# EAGLE design battle bunnies (EAGLE 7.7.0)
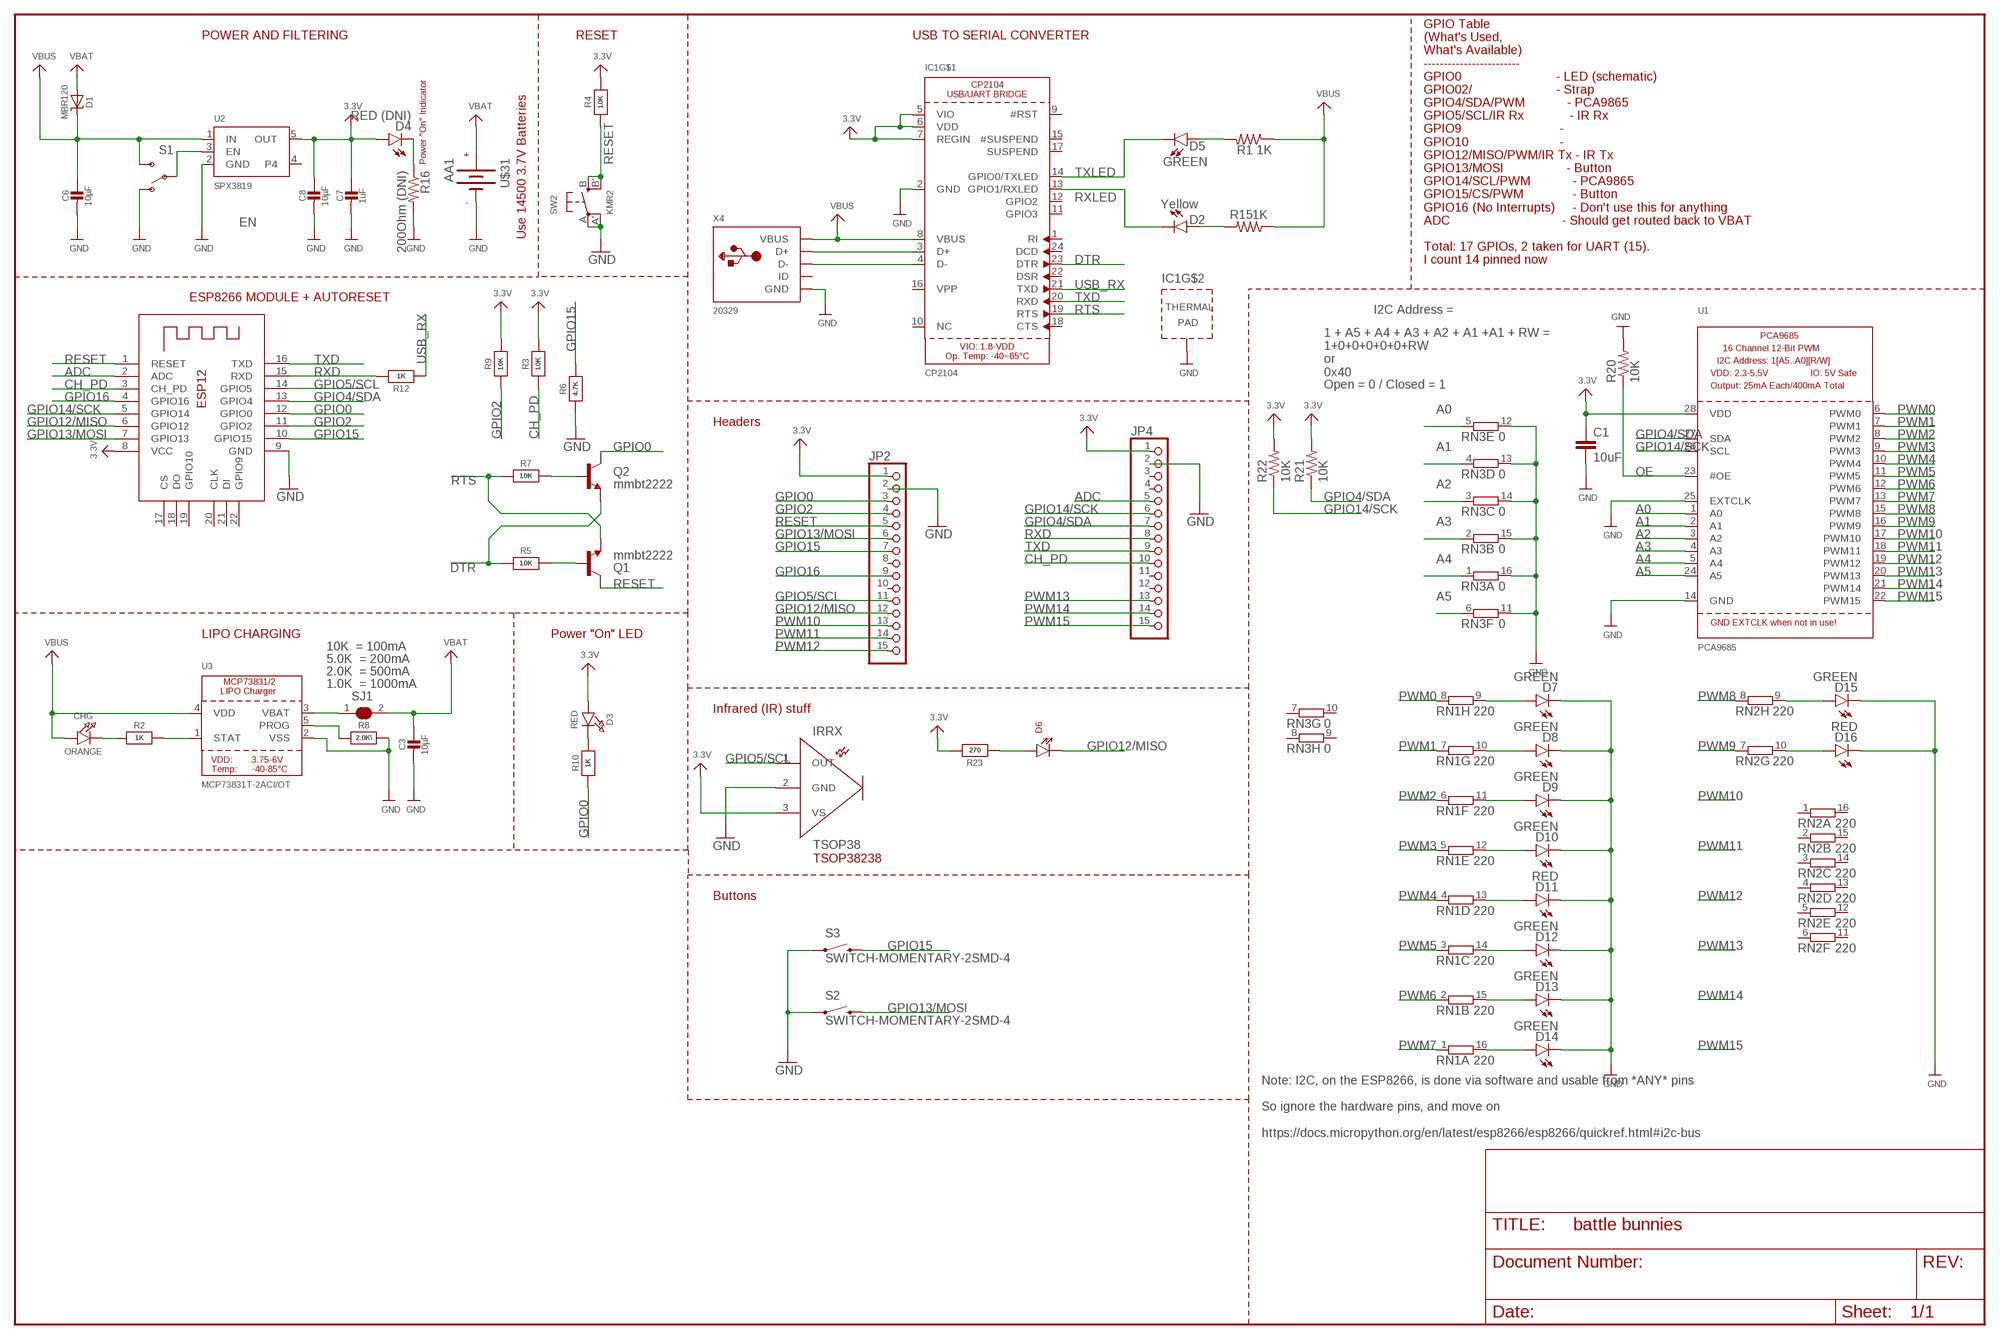
[diagram p0: schematic, sheet 1]

## Parts
C1  10uF  10UF10V10%(0805)  [0805-CAP]
C3  10µF  CAP_CERAMIC0805-NOOUTLINE  [0805-NO]
C6  10µF  CAP_CERAMIC0805-NOOUTLINE  [0805-NO]
C7  1uF  CAP_CERAMIC0603_NO  [0603-NO]
C8  10µF  CAP_CERAMIC0805-NOOUTLINE  [0805-NO]
CHG  ORANGE  LED0805_NOOUTLINE  [CHIPLED_0805_NOOUTLINE]
D1  MBR120  DIODE-SCHOTTKYSOD-123  [SOD-123]
D2  Yellow  LED-YELLOW0603  [LED-0603]
D3  RED  LED0805_NOOUTLINE  [CHIPLED_0805_NOOUTLINE]
D4  RED (DNI)  LED-RED0603  [LED-0603]
D5  GREEN  LED-GREEN0603  [LED-0603]
D6  LTE-302  [LTE-302]
D7  GREEN  LED-GREEN0603  [LED-0603]
D8  GREEN  LED-GREEN0603  [LED-0603]
D9  GREEN  LED-GREEN0603  [LED-0603]
D10  GREEN  LED-GREEN0603  [LED-0603]
D11  RED  LED-RED0603  [LED-0603]
D12  GREEN  LED-GREEN0603  [LED-0603]
D13  GREEN  LED-GREEN0603  [LED-0603]
D14  GREEN  LED-GREEN0603  [LED-0603]
D15  GREEN  LED-GREEN0603  [LED-0603]
D16  RED  LED-RED0603  [LED-0603]
IC1  CP2104  [QFN24_4MM_SMSC]
IRRX  TSOP38  [TSOP38]
JP2  PINHD-1X15  [1X15]
JP4  PINHD-1X15  [1X15]
Q1  mmbt2222  TRANSISTOR_NPNSOT23-3  [SOT23-3]
Q2  mmbt2222  TRANSISTOR_NPNSOT23-3  [SOT23-3]
R1  1K  1KOHM-1/10W-1%(0603)  [0603-RES]
R2  1K  RESISTOR_0603_NOOUT  [0603-NO]
R3  10K  RESISTOR_0603_NOOUT  [0603-NO]
R4  10K  RESISTOR_0603_NOOUT  [0603-NO]
R5  10K  RESISTOR_0603_NOOUT  [0603-NO]
R6  4.7K  RESISTOR_0603_NOOUT  [0603-NO]
R7  10K  RESISTOR_0603MP  [_0603MP]
R8  2.0K\  RESISTOR_0603_NOOUT  [0603-NO]
R9  10K  RESISTOR_0603_NOOUT  [0603-NO]
R10  1K  RESISTOR_0603_NOOUT  [0603-NO]
R12  1K  RESISTOR_0603MP  [_0603MP]
R15  1K  1KOHM-1/10W-1%(0603)  [0603-RES]
R16  200Ohm (DNI)  200OHM1/10W1%(0603)  [0603-RES]
R20  10K  RESISTOR0805-RES  [0805]
R21  10K  RESISTOR0805-RES  [0805]
R22  10K  RESISTOR0805-RES  [0805]
R23  270  RESISTOR_0603_NOOUT  [0603-NO]
RN1  220  8R-NEXB2HV  [EXB2HV]
RN2  220  8R-NEXB2HV  [EXB2HV]
RN3  0  8R-NEXB2HV  [EXB2HV]
S1  SWITCH-SPDT-SMD-A  [SWITCH-SPST-SMD-A]
S2  SWITCH-MOMENTARY-2SMD-4  [TACTILE_SWITCH_TALL]
S3  SWITCH-MOMENTARY-2SMD-4  [TACTILE_SWITCH_TALL]
SJ1  SOLDERJUMPER_CLOSED  [SOLDERJUMPER_CLOSEDWIRE@1]
SW2  KMR2  SWITCH_TACT_SMT4.6X2.8  [BTN_KMR2_4.6X2.8]
U1  PCA9685  [TSSOP28]
U2  SPX3819  VREG_SOT23-5  [SOT23-5]
U3  MCP73831T-2ACI/OT  MCP73831/2  [SOT23-5]
U$31  AA1  [AA1]
X2  ESP-12  ESP-12E  [ESP-12E]
X4  20329  USB_MICRO_20329_V2  [4UCONN_20329_V2]

## Nets
3.3V: C1.1 C7.1 C8.1 D3.A D4.A IC1.5(VIO) IC1.6(VDD) IC1.7(REGIN) IRRX.3(VS) JP2.1 JP4.1 R1.1 R3.2 R4.2 R9.2 R15.1 R21.2 R22.2 R23.2 U1.28(VDD) U2.5(OUT) X2.8(VCC) ; supply symbol labelled VBUS
A0: RN3.5 U1.1(A0)
A1: RN3.4 U1.2(A1)
A2: RN3.3 U1.3(A2)
A3: RN3.2 U1.4(A3)
A4: RN3.1 U1.5(A4)
A5: RN3.6 U1.24(A5)
ADC: JP4.5 X2.2(ADC)
CH_PD: JP4.10 R3.1 X2.3(CH_PD)
DTR: IC1.23(DTR) Q2.2(E) R5.1
EN: S1.2(P) U2.3(EN)
GND: C1.2 C3.2 C6.2 C7.2 C8.2 D7.C D8.C D9.C D10.C D11.C D12.C D13.C D14.C D15.C D16.C IC1.2(GND) IC1.THERM(TP) IRRX.2(GND) JP2.2 JP4.2 R6.1 R8.2 R16.2 R20.2 RN3.11 RN3.12 RN3.13 RN3.14 RN3.15 RN3.16 S1.1(O) S2.A2 S3.A2 SW2.A'(P1) SW2.A(P) U1.14(GND) U1.25(EXTCLK) U2.2(GND) U3.2(VSS) U$31.NEG(-) X2.9(GND) X4.BASE@1(GND) X4.BASE@2(GND) X4.GND X4.SPRT@1(GND) X4.SPRT@2(GND) X4.SPRT@3(GND) X4.SPRT@4(GND)
GPIO0: JP2.3 Q2.3(C) R10.1 X2.12(GPIO0)
GPIO2: JP2.4 R9.1 X2.11(GPIO2)
GPIO4/SDA: JP4.7 R21.1 U1.27(SDA) X2.13(GPIO4)
GPIO5/SCL: IRRX.1(OUT) JP2.11 X2.14(GPIO5)
GPIO12/MISO: D6.C JP2.12 X2.6(GPIO12)
GPIO13/MOSI: JP2.6 S2.B2 X2.7(GPIO13)
GPIO14/SCK: JP4.6 R22.1 U1.26(SCL) X2.5(GPIO14)
GPIO15: JP2.7 R6.2 S3.B2 X2.10(GPIO15)
GPIO16: JP2.9 X2.4(GPIO16)
N$1: CHG.C R2.1
N$2: R8.1 U3.5(PROG)
N$3: R2.2 U3.1(STAT)
N$4: D4.C R16.1
N$5: D3.C R10.2
N$8: D5.A R1.2
N$9: SJ1.1 U3.3(VBAT)
N$10: D2.A R15.2
N$12: Q1.1(B) R5.2
N$13: Q2.1(B) R7.2
N$14: D6.A R23.1
N$15: D13.A RN1.15
N$16: D14.A RN1.16
N$17: D12.A RN1.14
N$18: D11.A RN1.13
N$19: D10.A RN1.12
N$20: D9.A RN1.11
N$21: D8.A RN1.10
N$22: D7.A RN1.9
N$23: D15.A RN2.9
N$24: D16.A RN2.10
OE: R20.1 U1.23(#OE)
PWM0: RN1.8 U1.6(PWM0)
PWM1: RN1.7 U1.7(PWM1)
PWM2: RN1.6 U1.8(PWM2)
PWM3: RN1.5 U1.9(PWM3)
PWM4: RN1.4 U1.10(PWM4)
PWM5: RN1.3 U1.11(PWM5)
PWM6: RN1.2 U1.12(PWM6)
PWM7: RN1.1 U1.13(PWM7)
PWM8: RN2.8 U1.15(PWM8)
PWM9: RN2.7 U1.16(PWM9)
PWM10: JP2.13 U1.17(PWM10)
PWM11: JP2.14 U1.18(PWM11)
PWM12: JP2.15 U1.19(PWM12)
PWM13: JP4.13 U1.20(PWM13)
PWM14: JP4.14 U1.21(PWM14)
PWM15: JP4.15 U1.22(PWM15)
RESET: JP2.5 Q1.3(C) R4.1 SW2.B'(S1) SW2.B(S) X2.1(RESET)
RTS: IC1.19(RTS) Q1.2(E) R7.1
RXD: JP4.8 R12.2 X2.15(RXD)
RXLED: D2.C IC1.13(GPIO1/RXLED)
TXD: IC1.20(RXD) JP4.9 X2.16(TXD)
TXLED: D5.C IC1.14(GPIO0/TXLED)
USB_RX: IC1.21(TXD) R12.1
USBD_N [USB1]: IC1.4(D-) X4.D-
USBD_P [USB1]: IC1.3(D+) X4.D+
VBAT: C3.1 D1.A SJ1.2 U$31.POS(+)
VBUS: C6.1 CHG.A D1.C IC1.8(VBUS) S1.3(S) U2.1(IN) U3.4(VDD) X4.VBUS
Unconnected: IC1.1(RI) IC1.9(#RST) IC1.10(NC) IC1.11(GPIO3) IC1.12(GPIO2) IC1.15(#SUSPEND) IC1.16(VPP) IC1.17(SUSPEND) IC1.18(CTS) IC1.22(DSR) IC1.24(DCD) JP2.8 JP2.10 JP4.3 JP4.4 JP4.11 JP4.12 RN2.1 RN2.2 RN2.3 RN2.4 RN2.5 RN2.6 RN2.11 RN2.12 RN2.13 RN2.14 RN2.15 RN2.16 RN3.7 RN3.8 RN3.9 RN3.10 U2.4 X2.17(CS) X2.18(DO) X2.19(GPIO10) X2.20(CLK) X2.21(DI) X2.22(GPIO9) X4.ID

## Notes on the sheet
- POWER AND FILTERING | RESET | USB TO SERIAL CONVERTER
- Power "On" Indicator
- Use 14500 3.7V Batteries
- GPIO Table
  (What's Used,
  What's Available)
  ------------------------
  GPIO0                           - LED (schematic)
  GPIO02/                        - Strap
  GPIO4/SDA/PWM            - PCA9865
  GPIO5/SCL/IR Rx             - IR Rx
  GPIO9                            - 
  GPIO10                          - 
  GPIO12/MISO/PWM/IR Tx - IR Tx
  GPIO13/MOSI                  - Button
  GPIO14/SCL/PWM            - PCA9865
  GPIO15/CS/PWM              - Button
  GPIO16 (No Interrupts)     - Don't use this for anything
  ADC                                - Should get routed back to VBAT
  
  Total: 17 GPIOs, 2 taken for UART (15). 
  I count 14 pinned now
- ESP8266 MODULE + AUTORESET
- I2C Address =
- 1 + A5 + A4 + A3 + A2 + A1 +A1 + RW =
  1+0+0+0+0+0+RW
  or
  0x40
- Open = 0 / Closed = 1
- Headers
- LIPO CHARGING | Power "On" LED
- 10K  = 100mA
- 5.0K  = 200mA
- 2.0K  = 500mA
- 1.0K  = 1000mA
- Infrared (IR) stuff
- TSOP38238
- Buttons
- Note: I2C, on the ESP8266, is done via software and usable from *ANY* pins
  
  So ignore the hardware pins, and move on
  
  https://docs.micropython.org/en/latest/esp8266/esp8266/quickref.html#i2c-bus

## Library data of the parts
C1 = SparkFun-Capacitors:10UF10V10%(0805): CAP-11330; PROD_ID: CAP-11330
C3 C6-C8 = microbuilder:CAP_CERAMIC: Ceramic Capacitors For new designs, use the packages preceded by an '_' character since they are more reliable: The following footprints should be used on most boards: _0402 - Standard footprint for regular board layouts _0603 - Standard footprint for regular board layouts _0805 - Standard footprint for regular board layouts _1206 - Standard footprint for regular board layouts For extremely tight-pitch boards where space is at a premium, the following 'micro-pitch' footprints can be used (smaller pads, no silkscreen outline, etc.): _0402MP - Micro-pitch footprint for very dense/compact boards _0603MP - Micro-pitch footprint for very dense/compact boards _0805MP - Micro-pitch footprint for very dense/compact boards _1206MP - Micro-pitch footprint for very dense/compact boards
CHG D3 = microbuilder:LED: LED 0603 - 0603 Surface Mount Package 2mA: Green LED - Low Power (3.9mcd, 2ma, 1.7Vf) - Digikey: 475-2709-2-ND Orange LED - Low Power (9.8mcd, 2ma, 1.8Vf) - Digikey: 475-1194-2-ND Red LED - Low Power (5mcd, 2ma, 1.8Vf) - Digikey: 475-1195-2-ND Yellow LED - Low Power (7mcd, 2ma, 1.8Vf) - Digikey: 475-1196-2-ND 5mA: Blue LED - Low Power (17mcd, 5ma, 2.9Vf) - Digikey: LNJ937W8CRACT-ND 0805 - 0805 Surface Mount Package 2mA: Red LED (8.8mcd, 2mA, 1.8Vf, Clear) - Low Power [Digikey: 475-2510-1-ND] Green LED (5mcd, 2mA, 1.8Vf, Clear) - Low Power [Digikey: 475-2730-1-ND] Yellow LED (11.3mcd, 2mA, 1.8Vf, Clear) - Low Power [Digikey: 475-2555-1-ND] 20mA: Red LED (104mcd, 20mA, Diffused) - LS R976 [Digikey: 475-1278-6-ND] Red LED (12mcd, 20mA, 2.0Vf, Clear) - APT2012EC [Digikey: 754-1128-1-ND] Green LED (15mcd, 20mA, 2.2Vf, Clear) - APT2012GC [Digikey: 754-1131-1-ND] Orange LED (160mcd, 20mA, 2.1Vf, Clear) - APT2012SECK [Digikey: 754-1130-1-ND] 1206 - 1206 Surface Mount Package Green LED (26mcd, 20mA, Diffused) - LG N971 [Digikey: 475-1407-6-ND] Red LED (15mcd, 20mA, Diffused) - LH N974 [Digikey: 475-1416-6-ND] Cree - Cree High-Power Surface Mount LEDs XPEBWT-L1-0000-00D50 - White 111lm 350mA 2.9Vf 6200K 110° XTEAWT-00-0000-00000LEE3 - White 114lm 350mA 2.85Vf 5000K 115° Everlight - Everlight 45-21 Series Surface Mount LEDs 45-21/QK2C-B2832AC2CB2/2T - Warm White 2000mcd 20mA 3.25Vf 3050K 120° 45-21/LK2C-B38452C4CB2/2T - Nuetral White 2000mcd 20mA 3.25Vf 4150K 120° 45-21/LK2C-B50634C6CB2/2T - Cold White 2200mcd 20mA 3.25Vf 5650K 120° PLCC2 Reverse Mount LS T77K-J1L2-1-0-2-R18-Z - Red 11.25mcd 2mA 1.8Vf 630nm 120° LO T77K-L1M2-24-Z - Orange 19.6mcd 2mA 1.8Vf 606nm 120° LY T77K-K2M1-26-Z - Yellow 15.7mcd 2mA 1.8Vf 587nm 120°
D1 = microbuilder:DIODE-SCHOTTKY
D2 = SparkFun-LED:LED-YELLOW: Yellow SMD LEDs LilyPad 1206- DIO-09909 0603- DIO-09003 "SMART" means more efficient and expensive; PROD_ID: DIO-09003
D4 = SparkFun-LED:LED-RED: Assorted Red LEDs LilyPad 1206- DIO-09912 1206- DIO-00809 0603- DIO-00819 "SMART" means more efficient and expensive; PROD_ID: DIO-00819; VALUE: RED
D5 D7-D10 D12-D15 = SparkFun-LED:LED-GREEN: Various green LEDs Green LEDs used in SFE Production 0603- DIO-00821 LARGE- DIO-00862 LILYPAD- DIO-09910; PROD_ID: DIO-00821
D6 = SparkFun-LED:LTE-302: Through-hole side-firing 940nm IR LED
D11 D16 = SparkFun-LED:LED-RED: Assorted Red LEDs LilyPad 1206- DIO-09912 1206- DIO-00809 0603- DIO-00819 "SMART" means more efficient and expensive; PROD_ID: DIO-00819
IC1 = microbuilder:CP2104: CP2104 - USB to UART Bridge VDD Output: 3.45V
IRRX = Opto-electronics:TSOP38
JP2 JP4 = pinhead:PINHD-1X15: PIN HEADER
Q1 Q2 = SparkFun:TRANSISTOR_NPN: Transistor NPN BJT configuration in SOT23 package. MMBT2222 is the common NPN we use. Double check BCE configuration again layout.
R1 R15 = SparkFun-Resistors:1KOHM-1/10W-1%(0603): RES-07856; PROD_ID: RES-07856
R2-R10 R12 R23 = microbuilder:RESISTOR: Resistors For new designs, use the packages preceded by an '_' character since they are more reliable: The following footprints should be used on most boards: _0402 - Standard footprint for regular board layouts _0603 - Standard footprint for regular board layouts _0805 - Standard footprint for regular board layouts _1206 - Standard footprint for regular board layouts For extremely tight-pitch boards where space is at a premium, the following 'micro-pitch' footprints can be used (smaller pads, no silkscreen outline, etc.): _0402MP - Micro-pitch footprint for very dense/compact boards _0603MP - Micro-pitch footprint for very dense/compact boards _0805MP - Micro-pitch footprint for very dense/compact boards _1206MP - Micro-pitch footprint for very dense/compact boards
R16 = SparkFun-Resistors:200OHM1/10W1%(0603): RES-08220; PROD_ID: RES-08220; VALUE: 200
R20-R22 = SparkFun-Passives:RESISTOR: Resistor Basic schematic elements and footprints for 0603, 1206, and PTH resistors.
RN1-RN3 = resistor-dil:8R-N: DIL RESISTOR; OC_FARNELL: unknown; OC_NEWARK: unknown
S1 = SparkFun-Electromechanical:SWITCH-SPDT: SPDT Switch Simple slide switch, Spark Fun Electronics SKU : COM-00102 DPDT SMT slide switch, AYZ0202, SWCH-08179; PROD_ID: SWCH-10651
S2 S3 = SparkFun-Electromechanical:SWITCH-MOMENTARY-2: Various NO switches- pushbuttons, reed, etc; PROD_ID: SWCH-11966
SJ1 = microbuilder:SOLDERJUMPER_CLOSED: Solder Jumper - Closed These solder jumpers are closed by default CLOSEDWIRE - 10 mil trace between pads that can be cut and resoldered later CLOSEDPERM - 63 mil trace between pads for a permanent connection (used to 'bridge' two signals, a shameless hack for Eagle). Can double as a test point as well (no cream layer)
SW2 = microbuilder:SWITCH_TACT_SMT: SMT Tact Switches 6x6mm - Digikey: P12940SCT-ND KMR2 (4.6x2.8mm) - Digikey: 401-1426-1-ND EVQ-PQHB55 - Light Touch, 160GF (4.5x4.5mm) - Digikey: P8090SCT-ND KMT0 - KMT021 NGJ LHS (etc.) IP68/Waterproof - Digikey: CKN10289CT-ND
U1 = microbuilder:PCA9685: PCA9685 - 16 Channel 12-Bit I2C PWM Controller 5.0V tolerant 16 channel, 12-bit I2C PWM controller with 25mA per output (max. 400mA total) Digikey: 568-5931-1-ND
U2 = microbuilder:VREG_SOT23-5: SOT23-5 Fixed Voltage Regulators Part Current Out V Out V In V Dropout θJA (°C/W) TJ (°C) Digikey Part No. ADP121 150mA 3.3V 3.4-5.5V 0.09V @ 150mA -- -- ADP121-AUJZ33R7CT-ND ADP121 150mA 3.0V 3.1-5.5V 0.09V @ 150mA -- -- ADP121-AUJZ30R7CT-ND ADP122 300mA 3.3V 3.4-5.5V 0.085V @ 300mA -- -- ADP122AUJZ-3.3-R7CT-ND ADP1712 300mA 3.3V 3.5-5.5V 0.17V @ 300mA -- -- ADP1712AUJZ-3.3-R7TR-ND AP7311 (Low Cost) 150mA 3.3V 3.5-6V 0.15V @ 150mA -- -- AP7311-33WG-7DICT-ND LD39015M18R 150mA 1.8V 1.9V-5.5V 0.08V @ 100mA -- -- 497-6977-1-ND LP2985A-33DBVR 150mA 3.3V 3.3-16V 0.28V @ 150mA 206 150 296-18479-1-ND MCP1824T-3302E/OT 300mA 3.3V 3.5V-6V 0.2V @ 300mA -- -- MCP1824T-3302E/OTCT-ND MIC5205-2.5YM5 TR 150mA 2.5V 2.7-16V 0.165V @ 150mA -- -- 576-1257-2-ND MIC5205-3.0YM5 TR 150mA 3.0V 3.2V-16V 0.165V @ 150mA -- -- 576-1258-2-ND MIC5205-3.3YM5 TR 150mA 3.3V 3.5V-16V 0.165V @ 150mA -- -- 576-1259-2-ND TPS780330220 150mA 3.3V+2.2V 3.6-5.5V 250mV Max -- -- 296-23332-1-ND TDA3663/N1,135 100mA 3.3V 3.5-45V 0.18V @ 50mA -- -- 568-5343-1-ND Max operating temp can be calculated using θJA, TJ (max junction temperature), and power in watts. Set the "Maximum Ambient Temperature" until it reaches TJ ("Max Junction Temperature"), which is the absolute limit for safe use of the regulator: Heat Sink Temperature Calculator For example, With 12V source into a 3.3V LP2985 and a 30mA load, we are dissipating (12V-3.3V) * 0.03A = 0.261W. With a θJA of 206 °C/W, a TJ of 150°C, and 261mW we can safely use the chip without a heat sink up to 75°C (=147.1°C Junction Temperature).
U3 = microbuilder:MCP73831/2: MCP73831/2 LIPO Charger VDD: 3.75 - 6V Temp -40 - 85°C Programmable Charge Rate: 15-500mA NOTE: STAT is a tri-state logic output on the MCP73831 and an open-drain output on the MCP73832. SOT23-5 with 4.2V output and tri-state logic on STAT = MCP73831T-2ACI/OT
U$31 = Electromechanical:AA1
X2 = microbuilder:ESP-12E
X4 = microbuilder:USB: USB Connectors USBMINIB - Surface Mount Female Mini-B USB Connector 4UConnector: 06564

## Board
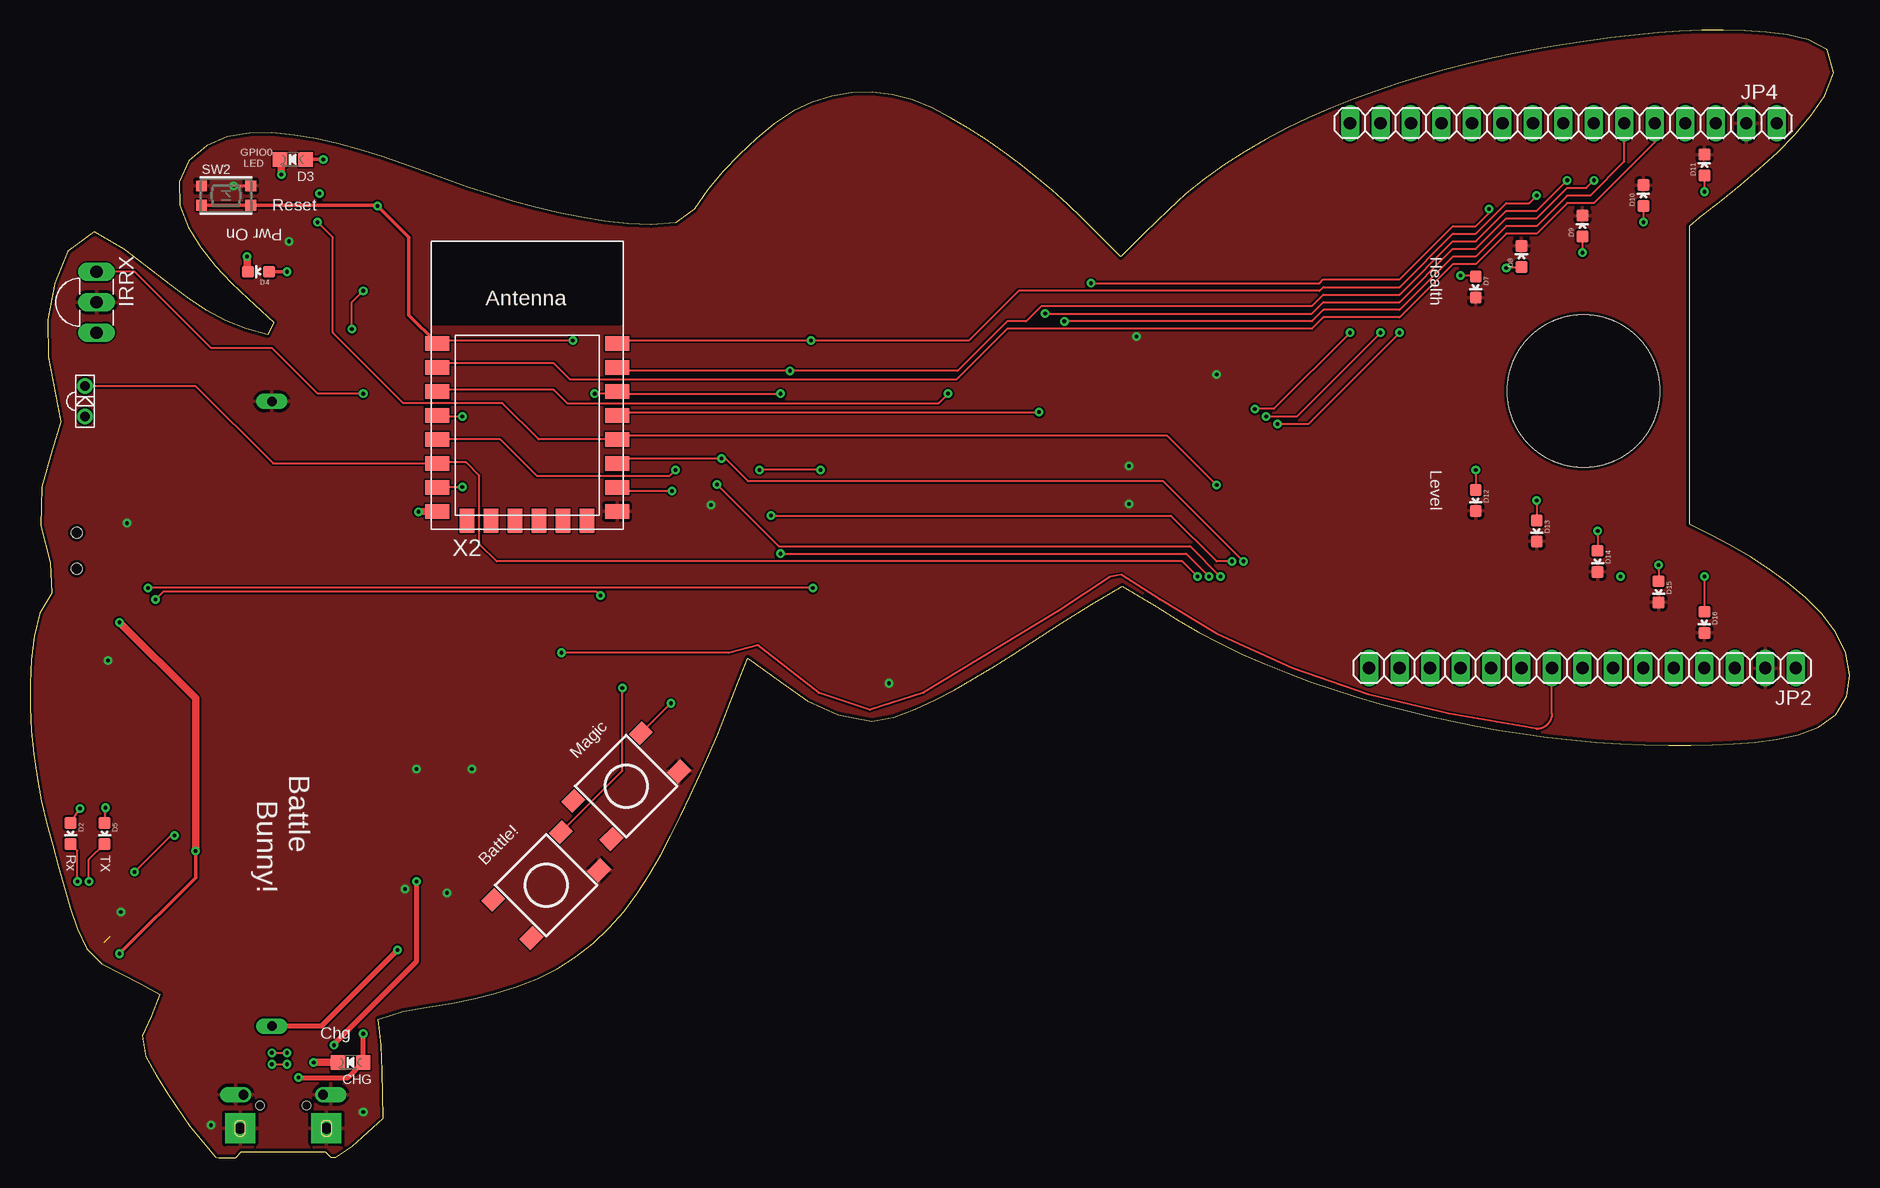
[diagram p1: board, top side]
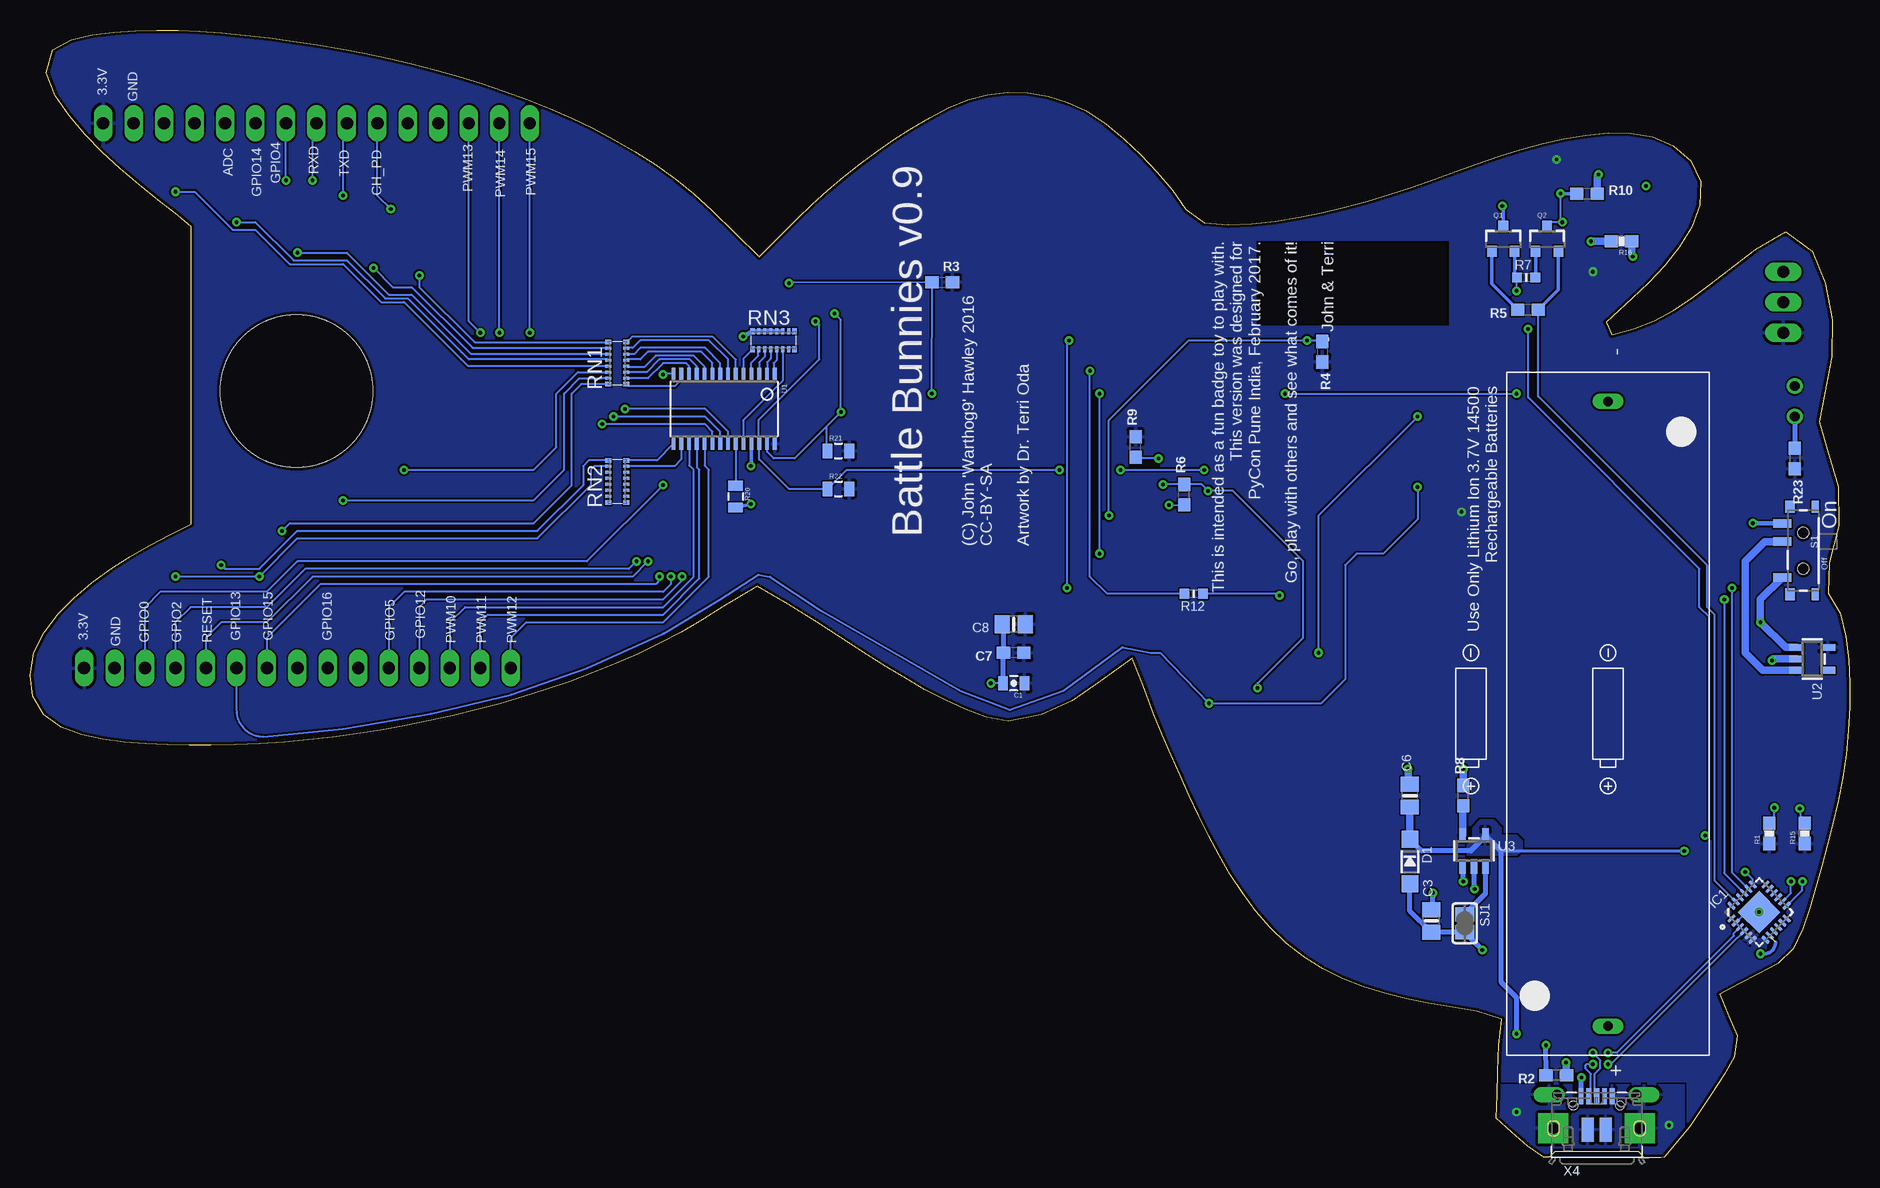
[diagram p2: board, bottom side, seen from below]

Size 151.65 x 93.96 mm. Coordinates in mm from the lower left corner, seen from the top.
Outline: 240 segments
Copper layers (1*16): Top 0.035mm / dielectric 1.5mm / Bottom 0.035mm
Design rules "default *": minimum track width 6mil, minimum drill 12mil, track to track 6mil, track to pad 6mil, pad to pad 6mil, via to via 6mil, smd to smd 6mil, copper to edge 10mil, drill to drill 8mil, minimum pad ring 10mil, minimum via ring 8mil, stop-mask expansion 4mil, vias tented up to drill 0mil, thermal gap 10mil
Holes 12.7 mm at 129.45,63.89

### Footprints (pad centres in the part's own frame; a part is rotated, then mirrored left to right if it is on the bottom)
0805-CAP = smd 0.8 x 1.2: 1 -0.9,0; 2 0.9,0
0805-NO = smd 1.24 x 1.5: 1 -0.95,0; 2 0.95,0
0603-NO = smd 1.1 x 1: 1 -0.85,0; 2 0.85,0
CHIPLED_0805_NOOUTLINE = smd 1.2 x 1.2: A 0,-1.05; C 0,1.05
SOD-123 = smd 1.4 x 1.4: A 1.85,0; C -1.85,0
LED-0603 = smd 1 x 1: A 0,-0.877; C 0,0.877
LTE-302 = drill 0.8: A 1.27,0; C -1.27,0
QFN24_4MM_SMSC = smd 0.8 x 0.28: 1 -2,1.25; 2 -2,0.75; 3 -2,0.25; 4 -2,-0.25; 5 -2,-0.75; 6 -2,-1.25; 13 2,-1.25; 14 2,-0.75; 15 2,-0.25; 16 2,0.25; 17 2,0.75; 18 2,1.25 | smd 0.28 x 0.8: 7 -1.25,-2; 8 -0.75,-2; 9 -0.25,-2; 10 0.25,-2; 11 0.75,-2; 12 1.25,-2; 19 1.25,2; 20 0.75,2; 21 0.25,2; 22 -0.25,2; 23 -0.75,2; 24 -1.25,2 | smd 2.5 x 2.5: THERM 0,0
TSOP38 = drill 1.016 long: 1 -2.54,0; 2 0,0; 3 2.54,0
1X15 = drill 1.016 long: 1 -17.78,0; 2 -15.24,0; 3 -12.7,0; 4 -10.16,0; 5 -7.62,0; 6 -5.08,0; 7 -2.54,0; 8 0,0; 9 2.54,0; 10 5.08,0; 11 7.62,0; 12 10.16,0; 13 12.7,0; 14 15.24,0; 15 17.78,0
SOT23-3 = smd 0.8 x 0.9: 1 -0.95,-1; 2 0.95,-1; 3 0,1.1
0603-RES = smd 1.1 x 1: 1 -0.85,0; 2 0.85,0
_0603MP = smd 0.8 x 0.8: 1 -0.762,0; 2 0.762,0
0805 = smd 0.8 x 1.2: 1 -0.9,0; 2 0.9,0
EXB2HV = smd 0.38 x 0.5: 1 -1.75,-0.75; 8 1.75,-0.75; 9 1.75,0.75; 16 -1.75,0.75 | smd 0.25 x 0.5: 2 -1.25,-0.75; 3 -0.75,-0.75; 4 -0.25,-0.75; 5 0.25,-0.75; 6 0.75,-0.75; 7 1.25,-0.75; 10 1.25,0.75; 11 0.75,0.75; 12 0.25,0.75; 13 -0.25,0.75; 14 -0.75,0.75; 15 -1.25,0.75
SWITCH-SPST-SMD-A = smd 0.7 x 1.5: 1 -2.25,-1.75; 2 -0.75,-1.75; 3 2.25,-1.75 | smd 1 x 0.6: GND1 -3.65,1; GND3 3.65,1 | smd 1 x 0.8: GND2 -3.65,-1.1; GND4 3.65,-1.1 | hole 0.9: -1.5,0; 1.5,0
TACTILE_SWITCH_TALL = smd 1.55 x 1.3: A1 -3.975,-2.25; A2 3.975,-2.25; B1 -3.975,2.25; B2 3.975,2.25
SOLDERJUMPER_CLOSEDWIRE@1 = smd 1.168 x 1.6: 1 -0.762,0; 2 0.762,0 | smd 0.635 x 0.203: WIRE 0,0
BTN_KMR2_4.6X2.8 = smd 0.9 x 0.9: A 2.05,0.8; A' -2.05,0.8; B 2.05,-0.8; B' -2.05,-0.8
TSSOP28 = smd 0.305 x 0.991: 1 -4.225,-2.918; 2 -3.575,-2.918; 3 -2.925,-2.918; 4 -2.275,-2.918; 5 -1.625,-2.918; 6 -0.975,-2.918; 7 -0.325,-2.918; 8 0.325,-2.918; 9 0.975,-2.918; 10 1.625,-2.918; 11 2.275,-2.918; 12 2.925,-2.918; 13 3.575,-2.918; 14 4.225,-2.918; 15 4.225,2.918; 16 3.575,2.918; 17 2.925,2.918; 18 2.275,2.918; 19 1.625,2.918; 20 0.975,2.918; 21 0.325,2.918; 22 -0.325,2.918; 23 -0.975,2.918; 24 -1.625,2.918; 25 -2.275,2.918; 26 -2.925,2.918; 27 -3.575,2.918; 28 -4.225,2.918
SOT23-5 = smd 0.55 x 1.2: 1 -0.95,-1.3; 2 0,-1.3; 3 0.95,-1.3; 4 0.95,1.3; 5 -0.95,1.3
AA1 = drill 0.8 long: NEG -26.035,0; POS 26.035,0
ESP-12E = smd 2 x 1.2: 1 -7.5,5.77; 2 -7.5,3.77; 3 -7.5,1.77; 4 -7.5,-0.23; 5 -7.5,-2.23; 6 -7.5,-4.23; 7 -7.5,-6.23; 8 -7.5,-8.23; 9 7.5,-8.23; 10 7.5,-6.23; 11 7.5,-4.23; 12 7.5,-2.23; 13 7.5,-0.23; 14 7.5,1.77; 15 7.5,3.77; 16 7.5,5.77 | smd 1.2 x 2: 17 -5,-9; 18 -3,-9; 19 -1,-9; 20 1,-9; 21 3,-9; 22 5,-9
4UCONN_20329_V2 = smd 1 x 2: BASE@1 -0.75,-2; BASE@2 0.75,-2 | smd 0.4 x 1.35: D+ 0,0.775; D- -0.65,0.775; GND 1.3,0.775; ID 0.65,0.775; VBUS -1.3,0.775 | drill 0.8 pad 1.2 offset: SPRT@1 -3.3,0.9; SPRT@2 3.3,0.9 | drill 0.9 pad 2.5 square: SPRT@3 -3.6,-1.9; SPRT@4 3.6,-1.9 | hole 0.7: -1.95,0; 1.95,0

### Placement (x,y rotation side)
C1  69.68,39.52 180 bottom
C3  34.88,19.71 90 bottom
C6  36.66,30.16 90 bottom
C7  69.68,42.06 180 bottom
C8  69.68,44.44 180 bottom
CHG  26.72,7.93 90 top
D1  36.66,24.66 270 bottom
D2  3.39,27.01 180 top
D3  21.9,83.18 90 top
D4  19.04,73.81 90 top
D5  6.21,27.01 180 top
D6  4.59,63.02 270 top
D7  120.48,72.54 180 top
D8  124.29,75.08 0 top
D9  129.37,77.62 0 top
D10  134.45,80.16 0 top
D11  139.53,82.7 0 top
D12  120.48,54.76 180 top
D13  125.56,52.22 180 top
D14  130.64,49.68 180 top
D15  135.72,47.14 180 top
D16  139.53,44.6 180 top
IC1  7.57,20.45 45 bottom
IRRX  5.55,71.27 270 top
JP2  129.37,40.79 180 top
JP4  127.78,86.19 180 top
Q1  28.88,76.51 0 bottom
Q2  25.23,76.51 0 bottom
R1  6.72,27.01 90 bottom
R2  24.47,6.85 180 bottom
R3  75.63,72.94 0 bottom
R4  43.96,67.14 270 bottom
R5  26.82,70.64 180 bottom
R6  55.47,55.24 90 bottom
R7  26.98,73.34 0 bottom
R8  32.22,30.16 90 bottom
R9  59.52,59.21 90 bottom
R10  21.9,80.32 0 bottom
R12  54.68,46.98 180 bottom
R15  3.77,27.01 90 bottom
R16  19.04,76.35 180 bottom
R20  92.86,55.08 270 bottom
R21  84.29,58.89 0 bottom
R22  84.29,55.71 0 bottom
R23  4.59,58.25 270 bottom
RN1  102.7,66.19 90 bottom
RN2  102.7,56.35 90 bottom
RN3  89.68,68.1 0 bottom
S1  3.89,50.57 270 bottom
S2  49.68,30.95 45 top
S3  43.01,22.69 45 top
SJ1  32.09,19.52 270 bottom
SW2  16.34,80.16 0 top
U1  93.81,62.38 180 bottom
U2  3.13,41.55 270 bottom
U3  31.33,25.55 0 bottom
U$31  20.15,36.98 270 bottom
X2  41.42,62.06 0 top
X4  21.1,4.33 0 bottom

### Tracks (layer width: path | path; a pad name or v marks a point on that pad's centre or on a via)
3.3V  (via drill 0.3)
  Top 0.305: D3.A v24.44,83.18 | D4.A v21.42,73.81
  Top 0.61: X2.8 v32.37,53.81
  pour Bottom (rank 6): -0.17,-1.12 153.5,-1.12 153.5,99.21 -0.17,99.21
A0
  Bottom 0.152: RN3.5 89.43,66.44 89.68,66.19 89.68,65.4 U1.1
A1
  Bottom 0.152: RN3.4 89.93,66.58 90.24,66.27 U1.2
A2
  Bottom 0.152: RN3.3 90.43,66.71 90.89,66.26 U1.3
A3
  Bottom 0.152: U1.4 91.54,66.24 90.95,66.83 90.95,67.33 RN3.2
A4
  Bottom 0.152: U1.5 92.19,66.6 RN3.1
A5
  Bottom 0.152: RN3.6 88.93,64.72 92.22,61.43 92.22,59.5 U1.24
ADC
  Top 0.152: JP4.5 135.4,84.61 130.32,79.53 128.1,79.53 125.56,76.99 123.02,76.99 120.48,74.45 118.58,74.45 114.13,70 107.78,70 106.83,69.05 81.43,69.05 77.22,64.84 44.99,64.84 43.65,66.19 34.28,66.19 X2.2
CH_PD  (via drill 0.3, 0.3 pad 0.3)
  Top 0.152: X2.3 34.06,63.97 43.65,63.97 44.76,62.86 75.71,62.86 v76.5,63.65 | v88.41,72.86 107.46,72.86 107.78,73.18 114.13,73.18 118.58,77.62 120.48,77.62 121.59,78.73 v121.59,79.05
  Bottom 0.152: v76.5,63.65 R3.1 88.31,72.96 v88.41,72.86 | v121.59,79.05 122.7,80.16 JP4.10
DTR
  Bottom 0.152: R5.1 25.97,63.44 11.9,49.37 11.9,45.87 11.26,45.24 11.26,23.08 IC1.23
  Bottom 0.305: Q2.2 24.28,72.32 R5.1
EN
  Bottom 0.61: U2.3 7.26,40.6 8.72,42.06 8.72,49.68 7.08,51.32 S1.2
GND  (via drill 0.3, 0.3 pad 0.3)
  Top 0.305: SW2.A v16.98,80.96
  Bottom 0.152: U1.14 98.83,65.3 v98.89,65.24 | C1.2 v71.59,39.52 | IC1.2 8.63,20.45 IC1.THERM | v56.74,54.37 R6.1
  Bottom 0.305: R20.2 v91.59,54.44 | U1.25 91.54,57.67 v91.59,57.62 | C8.2 70.53,44.6
  Bottom 0.406: RN3.11 RN3.12 RN3.13 RN3.14 RN3.15 RN3.16 v92.22,68.41 | C1.2 70.58,42.06 C7.2 70.53,44.6 | S1.1 v8.09,52.86 | C3.2 34.76,20.79 v34.76,22.06 | U3.2 31.33,22.44 v31.26,22.38
  Bottom 0.61: R16.2 v21.58,76.35 | R8.2 v32.22,32.38 | U2.2 6.37,41.55 v6.5,41.43 | C6.2 36.82,31.27 v36.82,32.38
  other vias: 7.57,20.45 15.07,2.69 27.77,3.8
  pour Top: -0.17,-1.12 153.5,-1.12 153.5,99.21 -0.17,99.21
  pour Bottom: 13.8,2.22 13.8,6.03 19.99,6.03 19.99,3.96 23.17,3.96 23.17,6.03 29.2,6.03 29.36,3.33 25.39,0.15 25.07,0.15 24.6,0.63 17.61,0.63 17.13,0.15 15.55,0.15
GPIO0  (via drill 0.3, 0.3 pad 0.3)
  Top 0.152: v23.96,77.94 25.23,76.67 25.23,68.73 31.1,62.86 39.36,62.86 42.38,59.84 X2.12 49.24,60.15 94.77,60.15 v98.89,56.03
  Bottom 0.152: Q2.3 24.9,77.94 v23.96,77.94 24.12,78.1 v24.12,80.32 | v98.89,56.03 105.24,49.68 129.37,49.68 131.91,47.14 140.8,47.14 142.07,45.87 JP2.3
  Bottom 0.305: R10.1 v24.12,80.32
GPIO2  (via drill 0.3, 0.3 pad 0.3)
  Top 0.152: X2.11 49.34,58.26 v57.62,58.26 57.93,58.26 59.84,56.35 94.45,56.35 v101.11,49.68
  Bottom 0.152: v57.62,58.26 59.42,58.26 R9.1 | v101.11,49.68 101.75,49.05 128.74,49.05 131.91,45.87 138.26,45.87 139.53,44.6 JP2.4
GPIO4/SDA  (via drill 0.3 pad 0.3)
  Top 0.152: v84.08,62.12 49.2,62.12 X2.13 | v84.6,70.32 106.83,70.32 107.78,71.27 114.13,71.27 118.58,75.72 120.48,75.72 123.02,78.26 125.56,78.26 128.1,80.8 129.69,80.8 v130.32,81.43
  Bottom 0.152: 85.24,60.95 87.94,58.26 89.68,58.26 90.24,58.81 U1.27 | R21.1 85.24,58.94 85.24,60.95 | 85.24,60.95 v84.08,62.12 84.08,69.79 v84.6,70.32 | v130.32,81.43 JP4.7
GPIO5/SCL  (via drill 0.3, 0.3 pad 0.3)
  Top 0.152: v62.54,63.65 49.11,63.65 X2.14 48.74,63.65 v47.06,63.65 | IRRX.1 8.72,73.81 15.07,67.46 20.15,67.46 23.96,63.65 v27.77,63.65 | v62.54,50.32 96.35,50.32 v98.26,48.41
  Bottom 0.152: v62.54,63.65 v62.54,50.32 | v47.06,63.65 v27.77,63.65 | v98.26,48.41 98.26,47.78 98.89,47.14 120.48,47.14 121.75,45.87 JP2.11
GPIO12/MISO  (via drill 0.3 pad 0.3)
  Top 0.152: D6.C 13.8,64.29 20.25,57.84 X2.6 34.03,57.94 36.34,57.94 37.45,56.83 37.45,51.11 38.88,49.68 96.03,49.68 v97.3,48.41
  Bottom 0.152: JP2.12 119.21,45.87 118.58,46.51 98.89,46.51 97.3,48.09 v97.3,48.41
GPIO13/MOSI  (via drill 0.3 pad 0.3)
  Top 0.152: v36.03,55.87 35.59,55.84 X2.7 | S2.B2 51.9,36.35 51.91,36.35 v53.41,37.86
  Bottom 0.152: JP2.6 134.45,37.3 arc-90 132.23,35.08 125.56,35.71 118.26,36.98 111.59,38.57 105.24,40.79 98.89,43.65 94.13,46.51 90.95,48.57 90,48.41 85.71,45.55 74.13,38.89 70,37.3 65.55,38.89 60.63,42.54 58.25,42.06 57.46,42.06 v53.41,37.86 44.04,37.86 42.06,39.84 42.06,49.37 41.11,50.32 38.88,50.32 36.03,53.17 v36.03,55.87
GPIO14/SCK  (via drill 0.3 pad 0.3)
  Top 0.152: JP4.6 132.86,83.02 130.01,80.16 128.1,80.16 125.56,77.62 123.02,77.62 120.48,75.08 118.58,75.08 114.13,70.64 107.78,70.64 106.83,69.68 v86.19,69.68 | X2.5 39.21,59.84 42.22,56.83 53.33,56.83 v53.81,57.3 | v65.87,57.3 v60.79,57.3
  Bottom 0.152: v65.87,57.3 83.6,57.3 R22.1 88.41,55.72 90.89,58.19 U1.26 90.95,59.53 90.95,61.43 85.87,66.51 85.87,69.37 v86.19,69.68 | v60.79,57.3 v53.81,57.3
GPIO15  (via drill 0.3, 0.3 pad 0.3)
  Top 0.152: X2.10 49.12,56.03 49.6,55.56 v53.49,55.56 | v57.24,56.09 62.38,50.95 96.67,50.95 v99.21,48.41 | S3.B2 49.36,32.23 v49.36,39.13
  Bottom 0.152: v99.21,48.41 99.21,48.09 99.53,47.78 127.47,47.78 131.91,43.33 JP2.7 | v57.24,56.09 R6.2 54.02,56.09 v53.49,55.56 51.42,55.56 45.55,49.68 45.55,43.33 49.36,39.52 v49.36,39.13
GPIO16  (via drill 0.3)
  Top 0.152: 34.15,62.06 arc90 X2.4 34.01,61.75 v36.03,61.75 | v44.28,42.06 58.25,42.06 60.63,42.7 65.71,38.73 70,37.3 74.44,38.73 85.71,45.55 90,48.41 90.95,48.57 94.13,46.51 98.89,43.65 105.24,40.79 111.59,38.57 118.26,36.98 125.56,35.71 arc90 126.83,36.98 JP2.9
  Bottom 0.152: v44.28,42.06 44.28,53.49 v36.03,61.75
N$1  (via drill 0.3)
  Top 0.61: CHG.C v23.64,7.93
  Bottom 0.61: v23.64,7.93 R2.1
N$2
  Bottom 0.61: R8.1 32.28,29.25 U3.5
N$3  (via drill 0.3, 0.3 pad 0.3)
  Top 0.406: v25.33,9.36 25.23,9.36 32.22,16.34 v32.22,23.01
  Bottom 0.406: R2.2 v25.33,9.36 | v32.22,23.01 32.22,24.19 U3.1
N$4  (via drill 0.3)
  Top 0.61: v18.09,75.08 18.09,73.89 D4.C
  Bottom 0.61: R16.1 18.19,75.18 v18.09,75.08
N$5  (via drill 0.3)
  Top 0.61: v20.94,81.91 20.94,83.08 D3.C
  Bottom 0.61: R10.2 21.05,81.81 v20.94,81.91
N$8  (via drill 0.3 pad 0.3)
  Top 0.152: v6.29,29.15 6.21,28.75 D5.A
  Bottom 0.152: R1.2 6.29,28.13 v6.29,29.15
N$9
  Bottom 0.406: U3.3 30.38,21.99 SJ1.1
N$10  (via drill 0.3 pad 0.3)
  Top 0.152: D2.A 3.98,28.8 v4.17,29.07
  Bottom 0.152: R15.2 4.02,28.12 v4.17,29.07
N$12
  Bottom 0.305: Q1.1 29.83,72.8 R5.2
N$13
  Bottom 0.305: Q2.1 26.18,73.37 R7.2
N$14
  Bottom 0.406: D6.A R23.1
N$15  (via drill 0.3)
  Top 0.152: v125.56,54.76 D13.A
  Bottom 0.152: RN1.15 103.95,64.94 103.97,64.92 105.88,64.92 107.15,63.65 107.15,57.3 109.69,54.76 v125.56,54.76
N$16  (via drill 0.3)
  Top 0.152: v130.64,52.22 D14.A
  Bottom 0.152: RN1.16 105.72,64.44 106.51,63.65 106.51,56.03 109.69,52.86 130.01,52.86 v130.64,52.22
N$17  (via drill 0.3)
  Top 0.152: v120.48,57.3 D12.A
  Bottom 0.152: RN1.14 105.99,65.44 107.78,63.65 107.78,59.21 109.69,57.3 v120.48,57.3
N$18  (via drill 0.3)
  Top 0.152: D11.A v139.53,80.48
  Bottom 0.152: v139.53,80.48 137.94,80.48 134.77,77.3 132.86,77.3 130.01,74.45 125.56,74.45 122.39,71.27 120.48,71.27 116.67,67.46 115.72,66.51 115.15,65.94 RN1.13
N$19  (via drill 0.3)
  Top 0.152: D10.A v134.45,77.94
  Bottom 0.152: RN1.12 103.52,66.51 115.08,66.51 115.4,66.83 115.72,67.15 120.16,71.59 122.07,71.59 125.24,74.76 129.69,74.76 132.86,77.94 v134.45,77.94
N$20  (via drill 0.3)
  Top 0.152: D9.A v129.37,75.4
  Bottom 0.152: v129.37,75.4 125.24,75.4 121.75,71.91 119.85,71.91 114.88,66.94 RN1.11
N$21  (via drill 0.3)
  Top 0.152: D8.A 124.22,74.13 v123.02,74.13
  Bottom 0.152: v123.02,74.13 121.43,72.54 119.85,72.54 114.77,67.46 103.47,67.46 RN1.10
N$22  (via drill 0.3)
  Top 0.152: 120.41,73.49 v119.21,73.49
  Top 0.305: 120.41,73.49 D7.A
  Bottom 0.152: v119.21,73.49 119.21,72.54 114.61,67.94 RN1.9
N$23  (via drill 0.3)
  Top 0.152: v135.72,49.37 D15.A
  Bottom 0.152: v135.72,49.37 135.4,49.05 132.55,49.05 129.37,52.22 109.37,52.22 105.56,56.03 105.56,57.62 105.08,58.1 RN2.9
N$24  (via drill 0.3 pad 0.3)
  Top 0.152: 139.29,45.24 D16.A v139.53,48.41
  Bottom 0.152: v139.53,48.41 v132.55,48.41 129.37,51.59 109.37,51.59 104.92,56.03 104.92,57.3 104.63,57.6 RN2.10
OE
  Bottom 0.152: U1.23 92.84,56 R20.1
PWM0
  Bottom 0.152: U1.6 92.84,66.49 94.76,68.41 101.48,68.41 RN1.8
PWM1
  Bottom 0.152: U1.7 93.49,66.5 95.08,68.1 100.8,68.1 101.43,67.46 101.93,67.46 RN1.7
PWM2
  Bottom 0.152: U1.8 94.14,66.2 95.4,67.46 100.8,67.46 101.32,66.94 RN1.6
PWM3
  Bottom 0.152: U1.9 94.79,66.21 95.72,67.15 100.16,67.15 100.8,66.51 101.88,66.51 RN1.5
PWM4
  Bottom 0.152: U1.10 95.44,65.91 96.35,66.83 99.53,66.83 100.48,65.88 101.88,65.88 RN1.4
PWM5
  Bottom 0.152: U1.11 96.09,65.93 96.67,66.51 99.21,66.51 100.28,65.44 RN1.3
PWM6
  Bottom 0.152: U1.12 96.74,65.94 96.99,66.19 98.89,66.19 100.16,64.92 101.93,64.92 RN1.2
PWM7
  Bottom 0.152: U1.13 97.39,64.84 97.94,64.29 101.8,64.29 RN1.1
PWM8
  Bottom 0.152: U1.15 99.4,58.1 RN2.8
PWM9
  Bottom 0.152: U1.16 97.39,58.17 97.94,57.62 101.93,57.62 RN2.7
PWM10
  Bottom 0.152: 116.67,41.74 JP2.13 116.67,44.6 115.4,45.87 98.89,45.87 96.35,48.41 96.35,57.3 96.74,57.69 U1.17
PWM11
  Bottom 0.152: U1.18 96.09,57.51 95.87,57.3 95.87,48.25 98.89,45.24 113.5,45.24 114.13,44.6 JP2.14
PWM12
  Bottom 0.152: JP2.15 111.59,43.33 110.32,44.6 98.89,44.6 95.08,48.41 95.08,57.3 95.44,57.66 U1.19
PWM13  (via drill 0.3, 0.3 pad 0.3)
  Top 0.152: v114.13,68.73 106.51,61.11 v103.97,61.11
  Bottom 0.152: U1.20 94.79,60.5 95.4,61.11 v103.97,61.11 | JP4.13 115.08,69.68 v114.13,68.73
PWM14  (via drill 0.3)
  Top 0.152: v112.54,68.73 105.56,61.75 v103.02,61.75
  Bottom 0.152: U1.21 94.14,60.48 95.4,61.75 v103.02,61.75 | v112.54,68.73 JP4.14
PWM15  (via drill 0.3)
  Top 0.152: v110,68.73 103.65,62.38 v102.07,62.38
  Bottom 0.152: U1.22 93.49,60.47 95.4,62.38 v102.07,62.38 | v110,68.73 JP4.15
RESET  (via drill 0.3, 0.3 pad 0.3)
  Top 0.152: v45.23,68.1 34.19,68.1 X2.1 | v61.74,53.49 95.08,53.49 98.89,49.68 v100.16,49.68
  Top 0.305: 33.22,68.15 X2.1 31.58,70.18 31.58,76.67 v28.96,79.29 28.89,79.36 SW2.B SW2.B'
  Bottom 0.152: R4.1 44.07,68.1 v45.23,68.1 55.08,68.1 61.74,61.43 v61.74,53.49 | v100.16,49.68 101.43,48.41 128.1,48.41 131.91,44.6 135.72,44.6 136.99,43.33 JP2.5
  Bottom 0.305: Q1.3 28.88,79.21 v28.96,79.29
RTS  (via drill 0.3, 0.3 pad 0.3)
  Top 0.152: v26.82,69.05 26.82,71.27 v27.77,72.23 | v8.72,23.81 11.74,26.82 v12.05,26.82
  Bottom 0.152: v26.82,69.05 26.82,63.34 12.53,49.05 12.53,45.87 11.74,45.08 11.74,27.14 v12.05,26.82 | v27.77,72.23 27.77,73.3 R7.1 | IC1.19 8.1,23.18 v8.72,23.81
  Bottom 0.305: Q1.2 27.93,73.53 R7.1
RXD  (via drill 0.3 pad 0.3)
  Top 0.152: 49.24,66.15 X2.15 49.2,65.56 v63.33,65.56 77.3,65.56 81.43,69.68 83.02,69.68 84.29,70.96 106.83,70.96 107.78,71.91 114.13,71.91 118.58,76.35 120.48,76.35 123.02,78.89 125.56,78.89 v128.1,81.43
  Bottom 0.152: v128.1,81.43 128.1,85.88 JP4.8 | v63.33,65.56 63.33,48.41 61.9,46.98 R12.2
RXLED  (via drill 0.3)
  Top 0.152: v3.96,23.01 3.96,25.56 D2.C
  Bottom 0.152: IC1.13 3.96,22.29 v3.96,23.01
TXD  (via drill 0.3, 0.3 pad 0.3)
  Top 0.152: X2.16 49.19,68.1 v65.08,68.1 78.25,68.1 82.38,72.23 107.46,72.23 107.78,72.54 114.13,72.54 118.58,76.99 120.48,76.99 123.02,79.53 124.93,79.53 v125.56,80.16 | v65.24,47.46 v9.83,47.46
  Bottom 0.152: v65.24,47.46 65.24,67.94 v65.08,68.1 | v125.56,80.16 125.56,85.88 JP4.9 | IC1.20 9.83,23.77 v9.83,47.46
TXLED  (via drill 0.3)
  Top 0.152: v4.91,23.01 4.91,24.83 D5.C
  Bottom 0.152: IC1.14 4.91,22.04 v4.91,23.01
USB_RX  (via drill 0.3)
  Top 0.152: v10.47,46.51 11.1,47.14 47.22,47.14 v47.53,46.83
  Bottom 0.152: v10.47,46.51 10.47,23.7 IC1.21 | R12.1 47.69,46.98 v47.53,46.83
USBD_N  (via drill 0.3)
  Top 0.152: v20.15,7.77 v21.42,7.77
  Bottom 0.152: X4.D- 21.57,5.44 21.57,6.97 22.06,7.45 22.06,7.61 arc90 21.9,7.77 v21.42,7.77 | IC1.4 9.88,17.82 19.93,7.77 v20.15,7.77
USBD_P  (via drill 0.3)
  Top 0.152: v20.15,8.72 v21.42,8.72
  Bottom 0.152: X4.D+ 21.14,5.07 21.27,5.07 21.27,6.97 20.79,7.45 20.79,8.09 v21.42,8.72 | IC1.3 9.67,18.69 9.67,18.47 19.41,8.72 v20.15,8.72
VBAT  (via drill 0.3)
  Top 0.406: v30.63,17.3 24.28,10.95 U$31.POS
  Bottom 0.406: D1.A 36.66,20.54 C3.1 SJ1.2 v30.63,17.3
VBUS  (via drill 0.3, 0.3 pad 0.3)  (1 unrouted)
  Top 0.305: v13.8,25.55 13.8,23.33 v7.45,16.98
  Top 0.406: v22.37,6.66 26.5,6.66 CHG.A v27.77,10.31
  Top 0.61: v7.45,44.6 13.8,38.25 v13.8,25.55
  Bottom 0.305: 29.04,25.52 v13.8,25.55 | 6.68,18.43 IC1.8 | 6.18,17.93 arc90 7.13,16.98 v7.45,16.98
  Bottom 0.406: D1.C 35.7,25.55 31.58,25.55 30.38,26.76 U3.4 29.04,25.52 29.04,14.6 27.77,13.33 v27.77,10.31 | X4.VBUS v22.37,6.66
  Bottom 0.61: S1.3 7.45,46.52 v7.45,44.6 5.35,42.5 U2.1 | C6.1 D1.C
  pour Bottom: 29.04,26.82 29.04,27.46 29.68,28.09 30.79,28.09 31.42,27.46 31.42,26.5 31.9,26.03 31.9,25.23 27.77,25.23 27.29,25.71 27.29,26.35 27.77,26.82

### Text on the board
tPlace: GPIO0 / LED | Reset | Pwr On | Health | Level | Magic | Battle / Bunny! | Rx | TX | Battle! | Chg
bPlace: GND | 3.3V | GPIO4 | PWM15 | PWM14 | CH_PD | TXD | RXD | GPIO14 | ADC | Battle Bunnies v0.9 | PWM13 | This is intended as a fun badge toy to play with. / This version was designed for / PyCon Pune India, February 2017. / / Go, play with others and see what comes of it! / / - John & Terri | Use Only Lithium Ion 3.7V 14500 / Rechargeable Batteries | On | (C) John 'Warthog9' Hawley 2016 / CC-BY-SA / / Artwork by Dr. Terri Oda | Off | PWM12 | PWM11 | PWM10 | GPIO12 | GPIO5 | GPIO16 | GPIO15 | GPIO13 | RESET | GPIO2 | GPIO0 | 3.3V | GND